# Altium schematic sheet Sheet.SchDoc
size A4
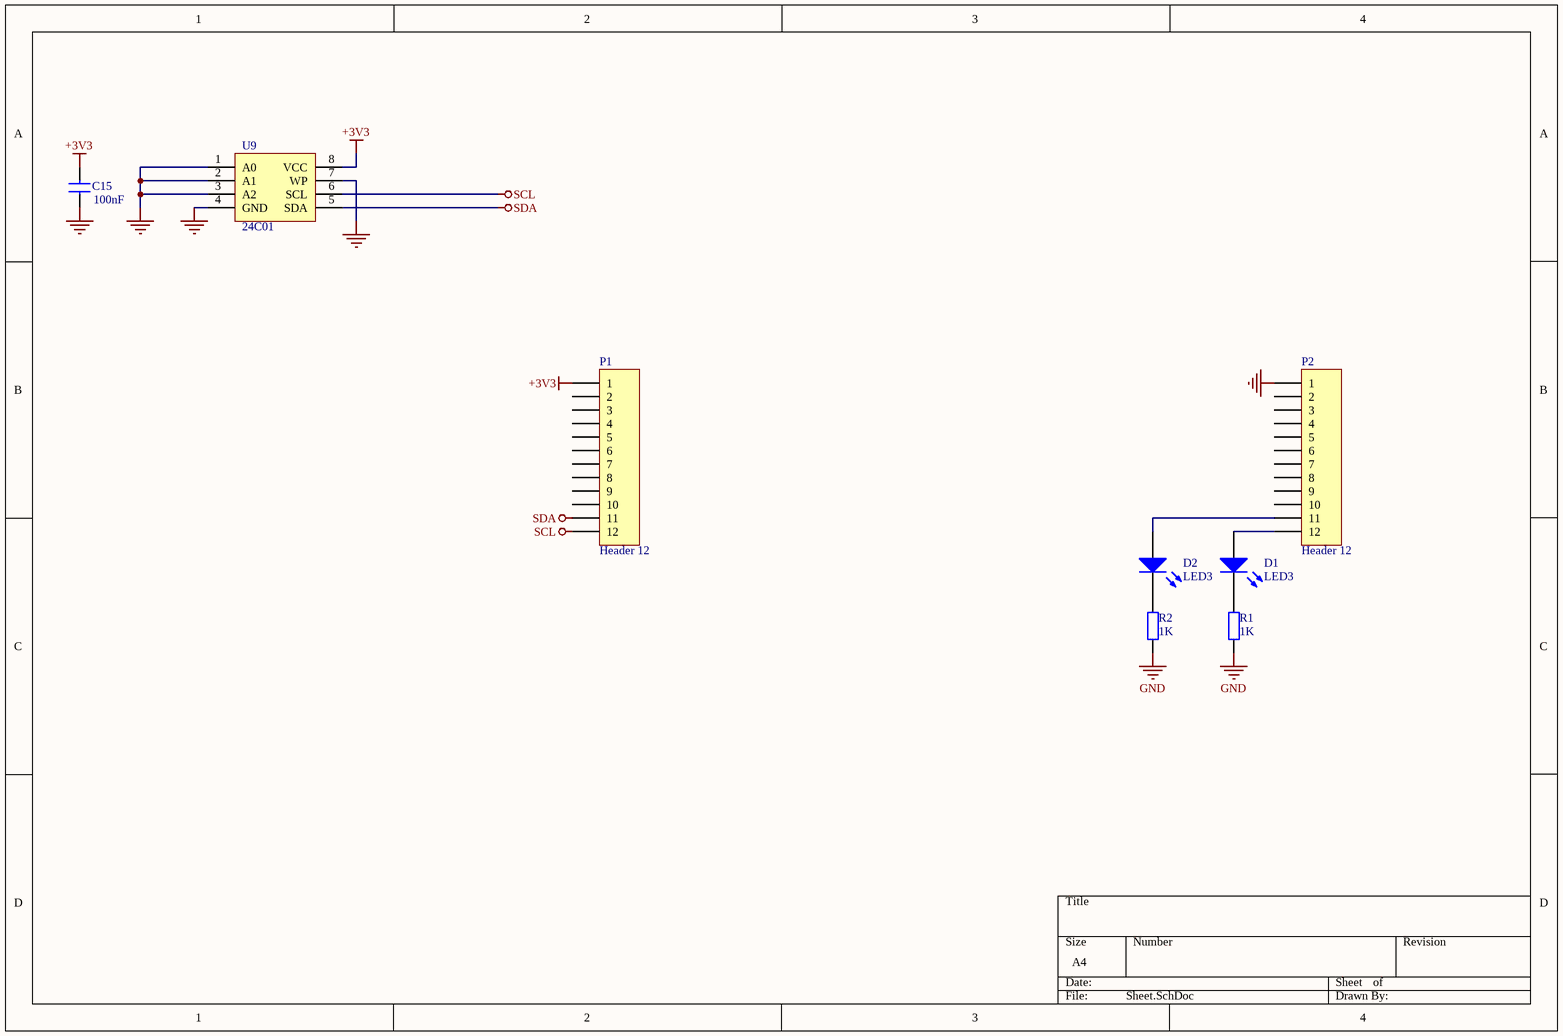
[diagram p0: Sheet.SchDoc]

## Parts
C15  100nF  [RESC2012X65M]
D1  LED3  [Led 0805]
D2  LED3  [Led 0805]
P1  Header 12  [HDR1X12]
P2  Header 12  [HDR1X12]
R1  1K  [0805]
R2  1K  [0805]
U9  24C01  [SO-8]

## Nets
+3V3: C15.1 P1.1 U9.8(VCC)
GND: C15.2 P2.1 R1.1 R2.1 U9.1(A0) U9.2(A1) U9.3(A2) U9.4(GND) U9.7(WP)
SCL: P1.12 U9.6(SCL)
SDA: P1.11 U9.5(SDA)
NetD1_1: D1.1(A) P2.12
NetD1_2: D1.2(K) R1.2
NetD2_1: D2.1(A) P2.11
NetD2_2: D2.2(K) R2.2

Not connected (* = marked no-connect by the designer): P1 2 3 4 5 6 7 8 9 10; P2 2 3 4 5 6 7 8 9 10

## Library data of the parts
C15 = CAP: Capacitor; IC: *
D1 D2 = LED3: Typical BLUE SiC LED; Published: 8-Jun-2000; LatestRevisionDate: 17-Dec-2003; LatestRevisionNote: PCB Footprint replaced.; DatasheetVersion: 16-Apr-2002; PackageVersion: 16-Apr-2002; PackageReference: 3.5X2.8X1.9; Publisher: Altium Limited; PackageDescription: SM LED; 2 C-Bend Leads; Body 3.5 x 2.8 x 1.9 mm, inc leads (LxWxH typ)
P1 P2 = Header 12: Header, 12-Pin; LatestRevisionDate: 17-Jul-2002; LatestRevisionNote: Re-released for DXP Platform.; Publisher: Altium Limited
R1 R2 = Res2: Resistor; Published: 8-Jun-2000; LatestRevisionDate: 17-Jul-2002; LatestRevisionNote: Re-released for DXP Platform.; PackageReference: AXIAL-0.4; Publisher: Altium Limited; PackageDescription: Axial Device, Thru-Hole; 2 Leads; 0.4 in Pin Spacing; Value: 1K